# EasyEDA schematic SCH_5.5-OLED-to-RP5-MIPI_2025-08-24.json
TITLE: Sheet_V1; REV: 1.0; Date: 2025-08-22; Sheet: 1/1; Drawn By: hjalte; Company: Your Company
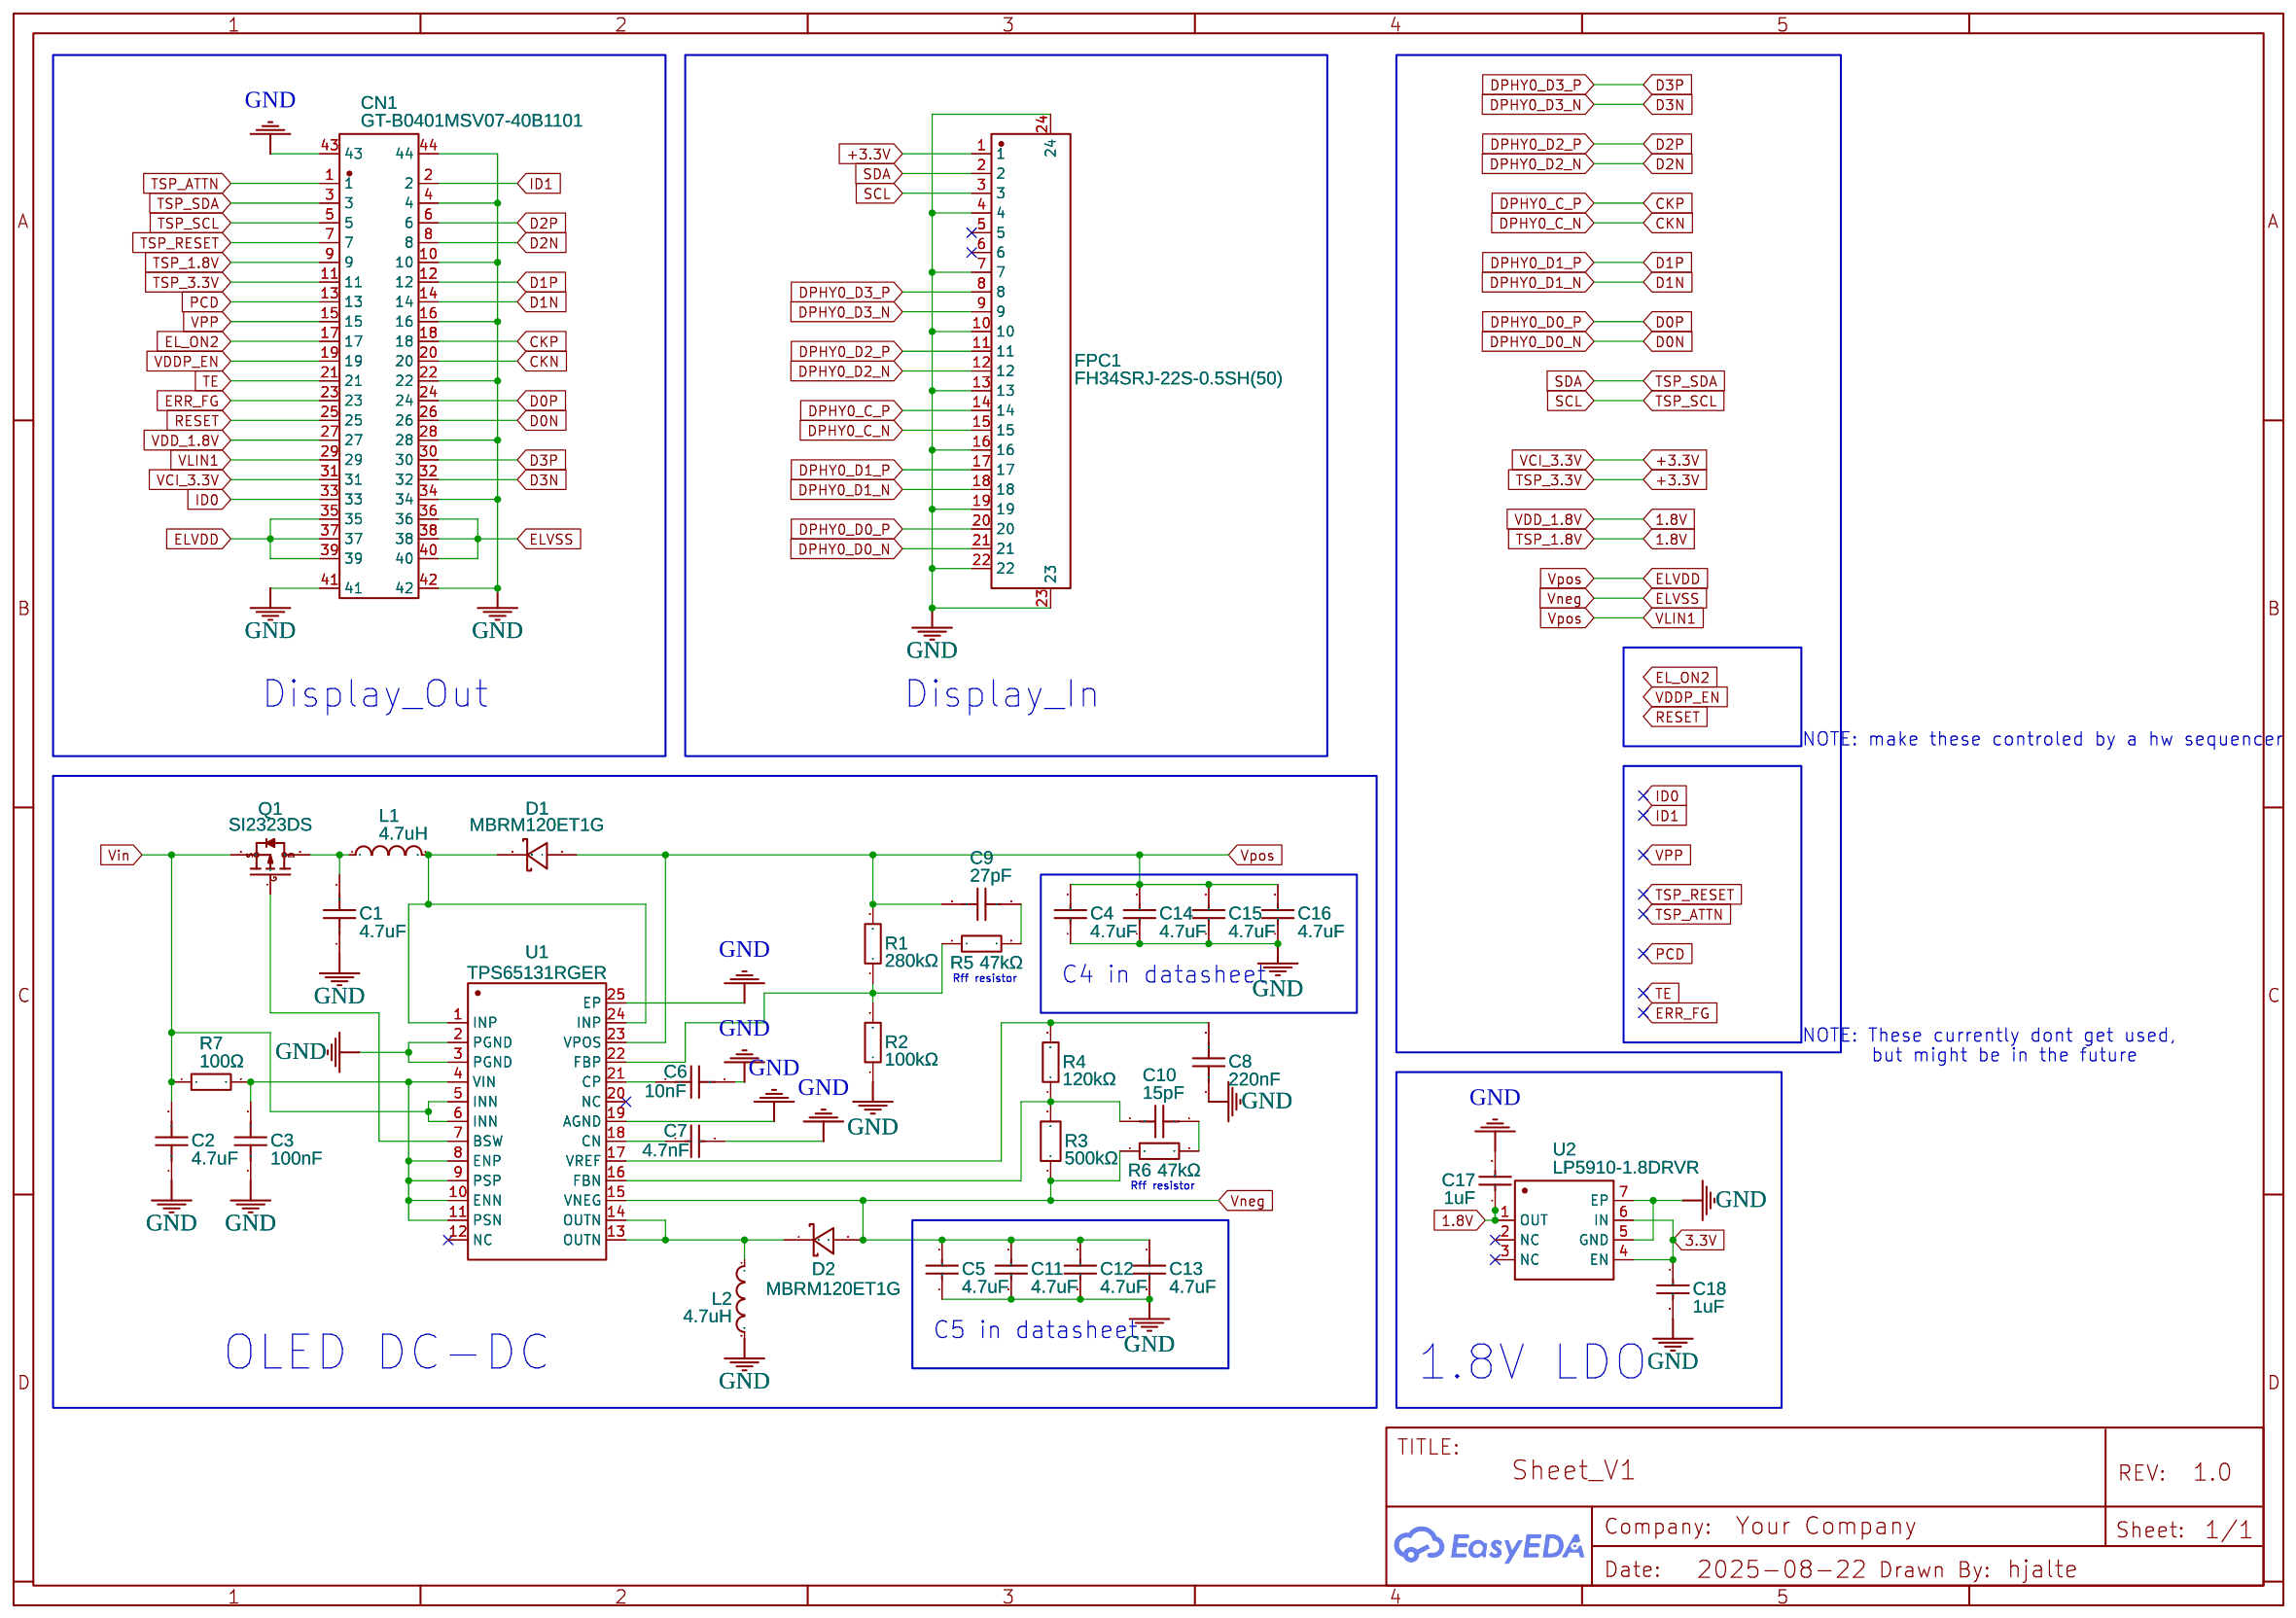
[diagram p0: schematic sheet]

## Parts
C1  4.7uF  [C0402]
C2  4.7uF  [C0402]
C3  100nF  [C0402]
C4  4.7uF  [C0805]
C5  4.7uF  [C0805]
C6  10nF  [C0402]
C7  4.7nF  [C0603]
C8  220nF  [C0402]
C9  27pF  [C0603]
C10  15pF  [C0402]
C11  4.7uF  [C0805]
C12  4.7uF  [C0805]
C13  4.7uF  [C0805]
C14  4.7uF  [C0805]
C15  4.7uF  [C0805]
C16  4.7uF  [C0805]
C17  1uF  [C0603]
C18  1uF  [C0603]
CN1  GT-B0401MSV07-40B1101  [CONN-SMD_40P-P0.40_GT-B0401MSV07-40B1101]
D1  MBRM120ET1G  [POWERMITE_L2.0-W1.9-LS3.8-RD]
D2  MBRM120ET1G  [POWERMITE_L2.0-W1.9-LS3.8-RD]
FPC1  FH34SRJ-22S-0.5SH(50)  [FFC-SMD_22P-P0.50_HRS_FH34SRJ-22S-0.5SH]
L1  4.7uH  [IND-SMD_L4.0-W4.0_FNR40XXS]
L2  4.7uH  [IND-SMD_L4.0-W4.0_FNR40XXS]
Q1  SI2323DS  [SOT-23-3_L2.9-W1.3-P1.90-LS2.4-BR]
R1  280kΩ  [R0603]
R2  100kΩ  [R0603]
R3  500kΩ  [R0603]
R4  120kΩ  [R0603]
R5  47kΩ  [R0603]
R6  47kΩ  [R0603]
R7  100Ω  [R0402]
U1  TPS65131RGER  [QFN-24_L4.0-W4.0-P0.50-TL-EP2.6]
U2  LP5910-1.8DRVR  [WSON-6_L2.0-W2.0-P0.65-TL-EP]

## Library data of the parts
C1 C2 = CL05A475MQ5NRNC_C307423: Contributor: LCSC; Supplier: LCSC; Supplier Part: C307423; Manufacturer: SAMSUNG(三星); Manufacturer Part: CL05A475MQ5NRNC; JLCPCB Part Class: Extended Part; Package Display: No
C3 = CL05B104KP5NNNC: Contributor: LCSC; Supplier: LCSC; Supplier Part: C133086; Manufacturer: SAMSUNG(三星); JLCPCB Part Class: Extended Part; Package Display: No
C4 C5 C11-C13 = CL21A475KAQNNNE: Supplier: LCSC; Manufacturer: SAMSUNG(三星); Supplier Part: C1779; JLCPCB Part Class: Basic Part
C6 = CL05B103KO5NNNC: Contributor: LCSC; Supplier: LCSC; Supplier Part: C318577; Manufacturer: SAMSUNG(三星); JLCPCB Part Class: Extended Part; Package Display: No
C7 = CL10B472KB8NNNC: Supplier: LCSC; Manufacturer: SAMSUNG(三星); Supplier Part: C1621; JLCPCB Part Class: Extended Part; Package Display: No
C8 = CL05A224KQ5NNNC: Contributor: LCSC; Supplier: LCSC; Supplier Part: C307417; Manufacturer: SAMSUNG(三星); JLCPCB Part Class: Extended Part; Package Display: No
C9 = CC0603JRNPO7BN270: Supplier: LCSC; Supplier Part: C2187529; Manufacturer: YAGEO(国巨); JLCPCB Part Class: Extended Part; Contributor: lcsc; Package Display: No
C10 = CC0402KRNPO7BN150: Supplier: LCSC; Supplier Part: C1852854; Manufacturer: YAGEO(国巨); JLCPCB Part Class: Extended Part; Contributor: lcsc; Package Display: No
C14-C16 = CL21A475KAQNNNE: Supplier: LCSC; Manufacturer: SAMSUNG(三星); Supplier Part: C1779; JLCPCB Part Class: Basic Part; Package Display: No
C17 C18 = CL10A105KO8NNNC: Supplier: LCSC; Manufacturer: SAMSUNG(三星); Supplier Part: C1592; JLCPCB Part Class: Extended Part
CN1 = GT-B0401MSV07-40B1101: Supplier: LCSC; Supplier Part: C42463143; Manufacturer: G-Switch(品赞); Contributor: lcsc
D1 D2 = MBRM120ET1G: Contributor: LCSC; Supplier Part: C152484; Supplier: LCSC; Manufacturer: onsemi(安森美); JLCPCB Part Class: Extended Part
FPC1 = FH34SRJ-22S-0.5SH(50): Contributor: LCSC; Supplier: LCSC; Supplier Part: C2889325; Manufacturer: HRS(广濑); JLCPCB Part Class: Extended Part
L1 L2 = FNR4020S4R7MT: Contributor: LCSC; Supplier: LCSC; Manufacturer: cjiang(长江微电); Supplier Part: C167828; JLCPCB Part Class: Extended Part
Q1 = SI2323DS: Contributor: lcsc; Supplier: LCSC; Supplier Part: C5182044; Manufacturer: TECH PUBLIC(台舟); JLCPCB Part Class: Extended Part
R1 = 0603WAF2803T5E: Supplier: LCSC; Manufacturer: UNI-ROYAL(厚声); Supplier Part: C22970; JLCPCB Part Class: Extended Part
R2 = 0603WAF1003T5E: Supplier: LCSC; Manufacturer: UNI-ROYAL(厚声); Supplier Part: C25803; JLCPCB Part Class: Basic Part
R3 = AR03BTCX5003N: Contributor: LCSC; Supplier: LCSC; Supplier Part: C2902631; Manufacturer: Viking(光颉); JLCPCB Part Class: Extended Part
R4 = 0603WAF1203T5E: Supplier: LCSC; Manufacturer: UNI-ROYAL(厚声); Supplier Part: C25808; JLCPCB Part Class: Basic Part
R5 R6 = RC0603FR-0747KL: Supplier: LCSC; Manufacturer: YAGEO(国巨); Supplier Part: C105579; JLCPCB Part Class: Extended Part
R7 = RC0402FR-07100RL: Supplier: LCSC; Manufacturer: YAGEO(国巨); Supplier Part: C106232; JLCPCB Part Class: Extended Part; Package Display: No
U1 = TPS65131RGER: Supplier: LCSC; Manufacturer: TI(德州仪器); Supplier Part: C87663; JLCPCB Part Class: Extended Part
U2 = LP5910-1.8DRVR: Contributor: LCSC; Supplier: LCSC; Supplier Part: C2867568; Manufacturer: TI(德州仪器); JLCPCB Part Class: Extended Part

## Nets
1.8V: C17.1 CN1.9 CN1.27 U2.1(OUT)
3.3V: C18.1 U2.4(EN) U2.6(IN)
+3.3V: CN1.11 CN1.31 FPC1.1
GND: C1.1 C2.1 C3.1 C4.1 C5.1 C6.2 C7.2 C8.1 C11.1 C12.1 C13.1 C14.1 C15.1 C16.1 C17.2 C18.2 CN1.4 CN1.10 CN1.16 CN1.22 CN1.28 CN1.34 CN1.41 CN1.42 CN1.43 CN1.44 FPC1.4 FPC1.7 FPC1.10 FPC1.13 FPC1.16 FPC1.19 FPC1.22 FPC1.23 FPC1.24 L2.2 R2.1 U1.2(PGND) U1.3(PGND) U1.19(AGND) U1.25(EP) U2.5(GND) U2.7(EP)
VDDP_EN: CN1.19
Vin: C2.2 Q1.2(S) R7.1 U1.5(INN) U1.6(INN)
CKN: CN1.20 FPC1.15
CKP: CN1.18 FPC1.14
D0N: CN1.26 FPC1.21
D0P: CN1.24 FPC1.20
D1N: CN1.14 FPC1.18
D1P: CN1.12 FPC1.17
D2N: CN1.8 FPC1.12
D2P: CN1.6 FPC1.11
D3N: CN1.32 FPC1.9
D3P: CN1.30 FPC1.8
EL_ON2: CN1.17
ELVDD: C4.2 C9.2 C14.2 C15.2 C16.2 CN1.29 CN1.35 CN1.37 CN1.39 D1.2(A) R1.2 U1.23(VPOS)
ELVSS: C5.2 C11.2 C12.2 C13.2 CN1.36 CN1.38 CN1.40 D2.2(A) R3.1 R6.1 U1.15(VNEG)
ERR_FG: CN1.23
ID0: CN1.33
ID1: CN1.2
PCD: CN1.13
RESET: CN1.25
SCL: CN1.5 FPC1.3
SDA: CN1.3 FPC1.2
TE: CN1.21
TSP_ATTN: CN1.1
TSP_RESET: CN1.7
VPP: CN1.15
Net-(C1-2): C1.2 L1.1 Q1.3(D)
Net-(C3-2): C3.2 R7.2 U1.4(VIN) U1.8(ENP) U1.9(PSP) U1.10(ENN) U1.11(PSN)
Net-(C6-1): C6.1 U1.21(CP)
Net-(C7-1): C7.1 U1.18(CN)
Net-(C8-2): C8.2 R4.2 U1.17(VREF)
Net-(C9-1): C9.1 R5.2
Net-(C10-1): C10.1 R6.2
Net-(C10-2): C10.2 R3.2 R4.1 U1.16(FBN)
Net-(D1-1): D1.1(C) L1.2 U1.1(INP) U1.24(INP)
Net-(D2-1): D2.1(C) L2.1 U1.13(OUTN) U1.14(OUTN)
Net-(Q1-1): Q1.1(G) U1.7(BSW)
Net-(R1-1): R1.1 R2.2 R5.1 U1.22(FBP)

Not connected (* = marked no-connect by the designer): FPC1 5* 6*; U1 12(NC)* 20(NC)*; U2 2(NC)* 3(NC)*

## Notes on the sheet
- Display_Out
- Display_In
- NOTE: make these controled by a hw sequencer
- Rff resistor
- C4 in datasheet
- NOTE: These currently dont get used,
- but might be in the future
- Rff resistor
- C5 in datasheet
- OLED DC-DC
- 1.8V LDO
